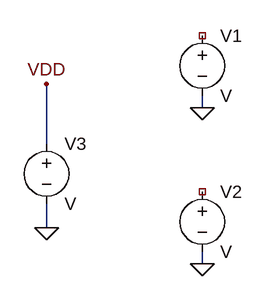
[diagram p0: schematic adder_4.asc]
adder_4.asc, the LTspice schematic file:
Version 4
SHEET 1 880 680
WIRE -16 64 -16 48
WIRE -224 112 -224 32
WIRE -224 224 -224 192
WIRE -16 272 -16 256
FLAG -224 224 0
FLAG -16 272 0
FLAG -16 64 0
FLAG -224 32 VDD
SYMBOL voltage -16 -48 R0
SYMATTR InstName V1
SYMBOL voltage -16 160 R0
SYMATTR InstName V2
SYMBOL voltage -224 96 R0
SYMATTR InstName V3

The netlist it stands for:
* adder_4.asc
V1 NC_01 0 V
V2 NC_02 0 V
V3 VDD 0 V
.backanno
.end